# EAGLE schematic Magus (EAGLE 9.1.1)
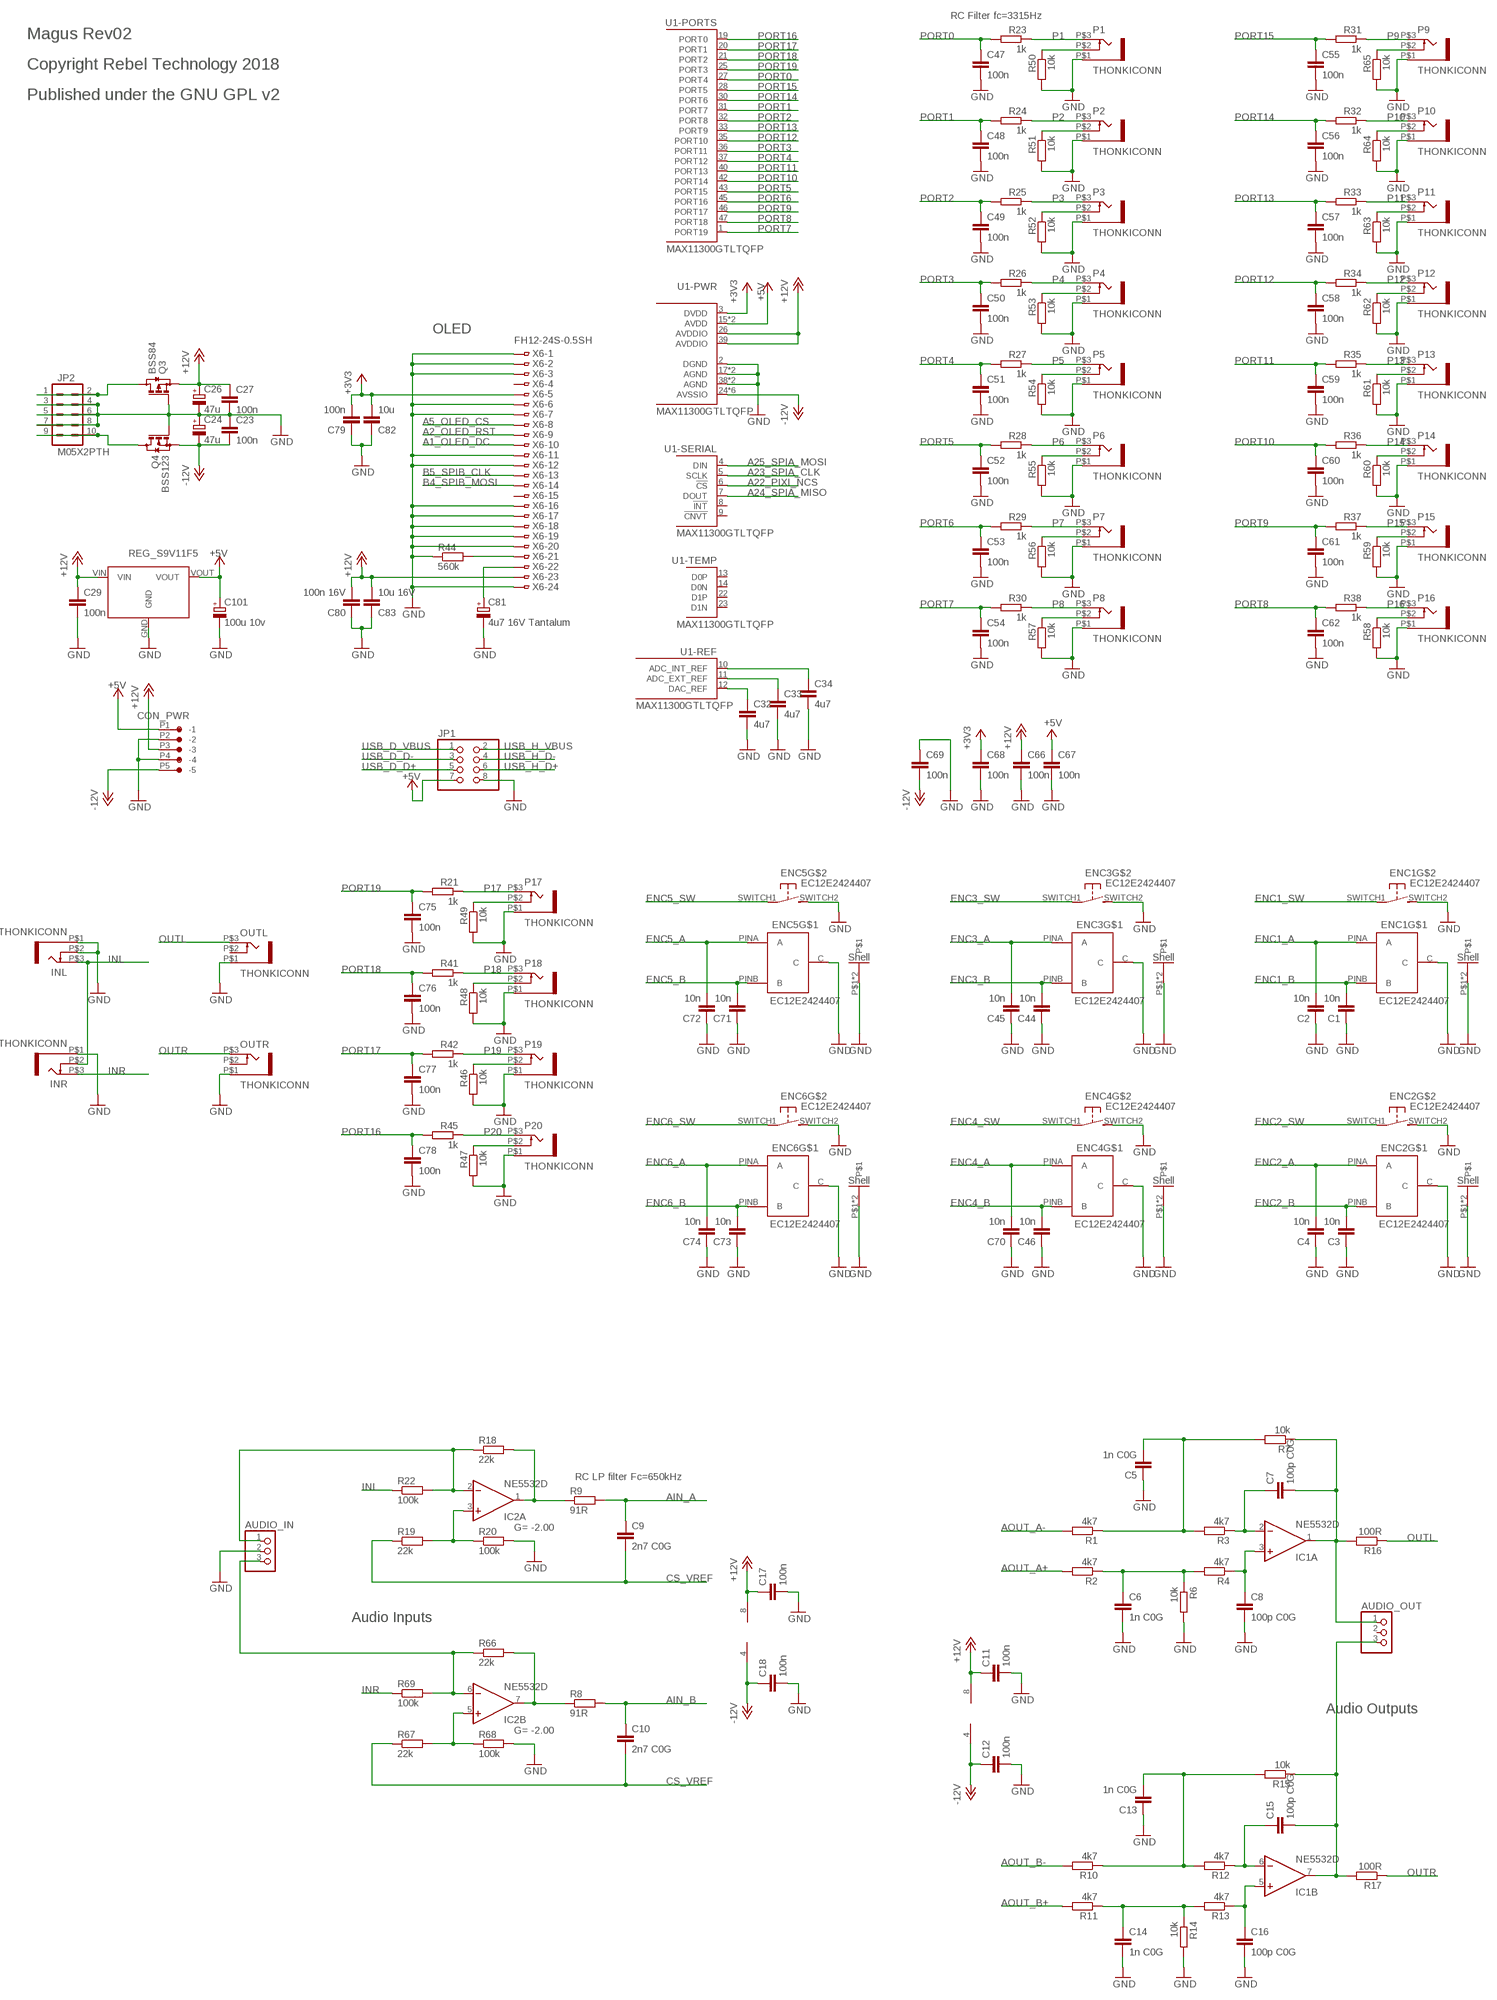
[diagram p0: schematic, sheet 1, part 1 of 2]
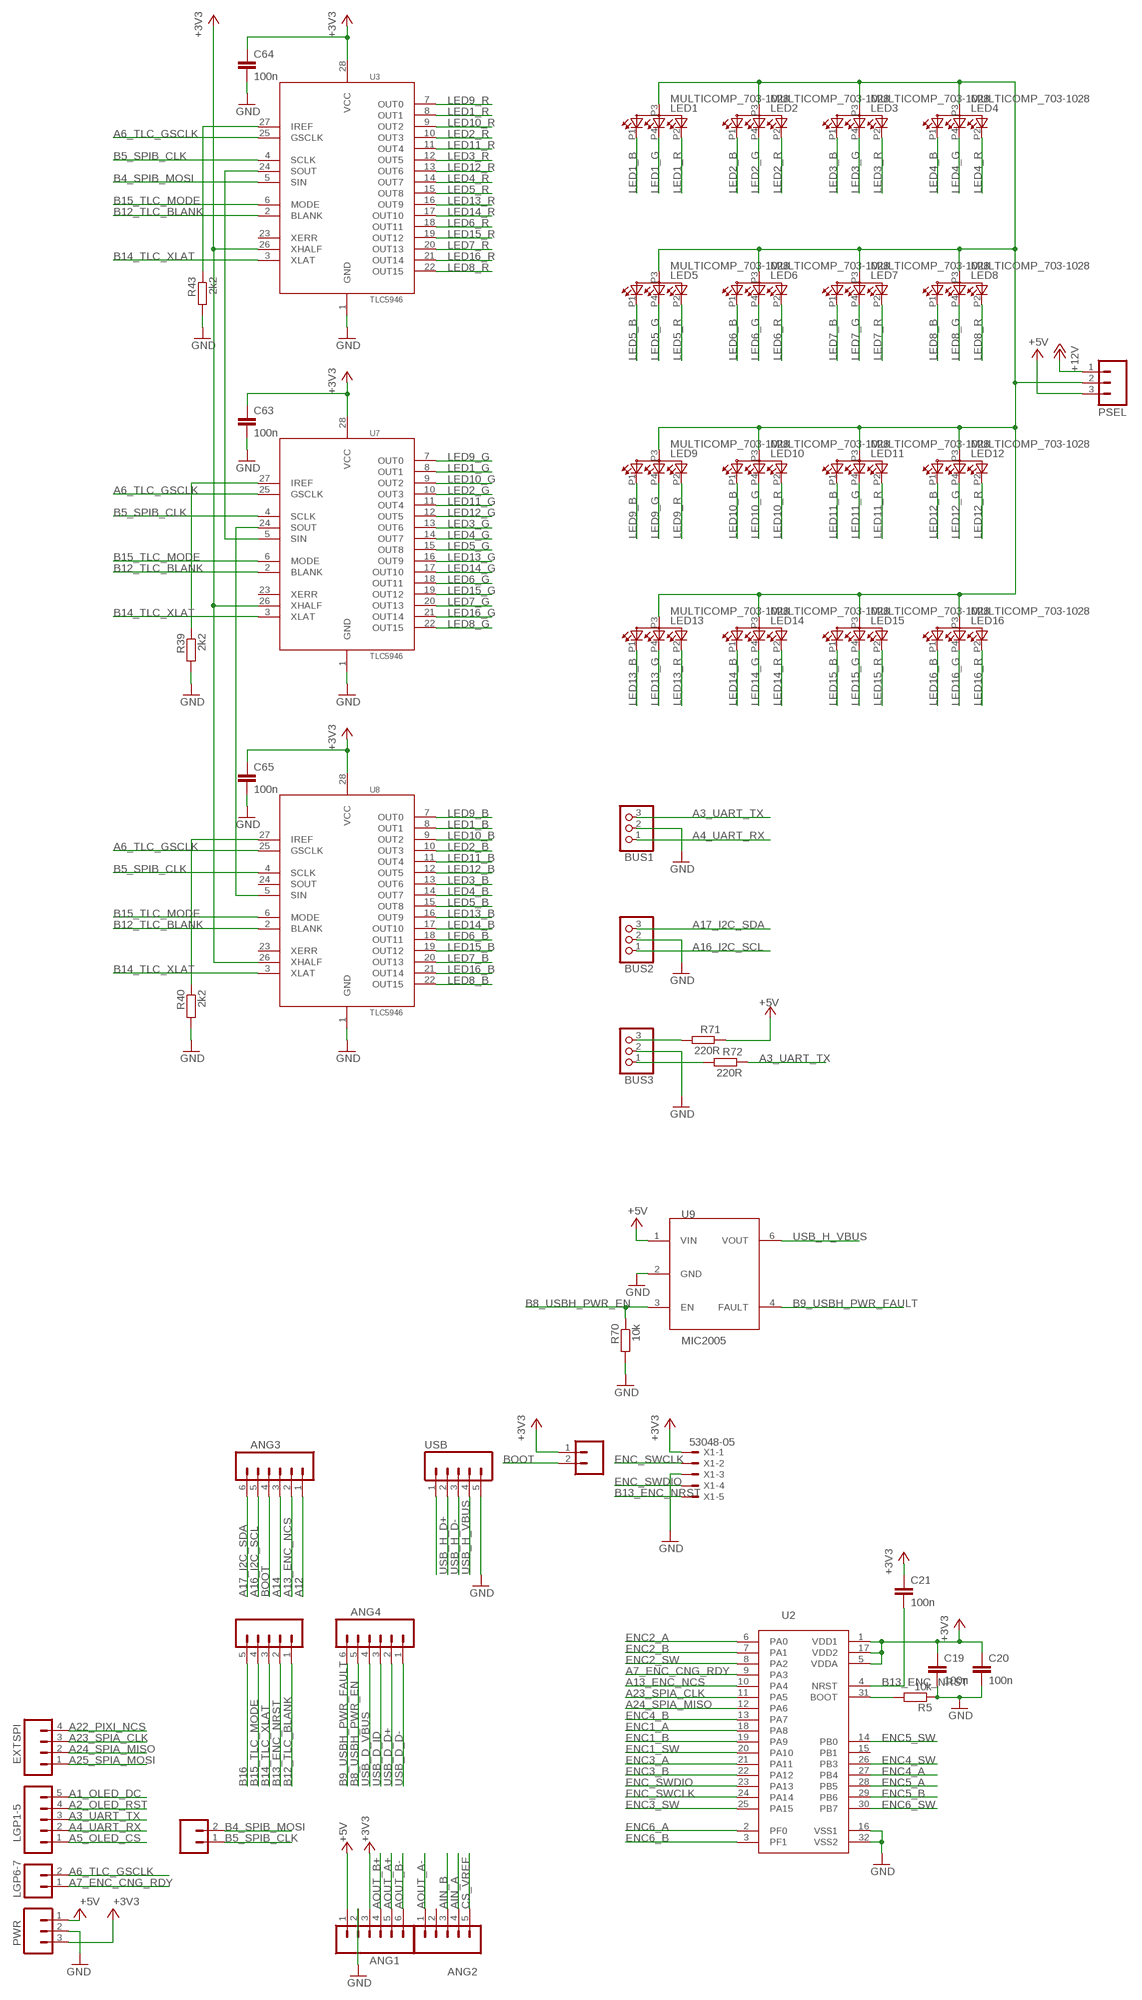
[diagram p1: schematic, sheet 1, part 2 of 2]

## Parts
ANG1  M06SIP  [1X06]
ANG2  M05PTH  [1X05]
ANG3  M06SIP  [1X06]
ANG4  M06SIP  [1X06]
AUDIO_IN  CON-JST-1X03PH-TH  [JST-B3B-PH-KL]
AUDIO_OUT  CON-JST-1X03PH-TH  [JST-B3B-PH-KL]
BOOT  M02PTH  [1X02]
BUS1  CON-JST-1X03PH-TH  [JST-B3B-PH-KL]
BUS2  CON-JST-1X03PH-TH  [JST-B3B-PH-KL]
BUS3  CON-JST-1X03PH-TH  [JST-B3B-PH-KL]
C1  10n  C-EUC0603  [C0603]
C2  10n  C-EUC0603  [C0603]
C3  10n  C-EUC0603  [C0603]
C4  10n  C-EUC0603  [C0603]
C5  1n C0G  C-EUC0603  [C0603]
C6  1n C0G  C-EUC0603  [C0603]
C7  100p C0G  C-EUC0603  [C0603]
C8  100p C0G  C-EUC0603  [C0603]
C9  2n7 C0G  C-EUC0603  [C0603]
C10  2n7 C0G  C-EUC0603  [C0603]
C11  100n  C-EUC0603  [C0603]
C12  100n  C-EUC0603  [C0603]
C13  1n C0G  C-EUC0603  [C0603]
C14  1n C0G  C-EUC0603  [C0603]
C15  100p C0G  C-EUC0603  [C0603]
C16  100p C0G  C-EUC0603  [C0603]
C17  100n  C-EUC0603  [C0603]
C18  100n  C-EUC0603  [C0603]
C19  100n  C-EUC0603  [C0603]
C20  100n  C-EUC0603  [C0603]
C21  100n  C-EUC0603  [C0603]
C23  100n  C-EUC0603  [C0603]
C24  47u  CPOL-EUB  [PANASONIC_B]
C26  47u  CPOL-EUB  [PANASONIC_B]
C27  100n  C-EUC0603  [C0603]
C29  100n  C-EUC0603  [C0603]
C32  4u7  C-EUC0603  [C0603]
C33  4u7  C-EUC0603  [C0603]
C34  4u7  C-EUC0603  [C0603]
C44  10n  C-EUC0603  [C0603]
C45  10n  C-EUC0603  [C0603]
C46  10n  C-EUC0603  [C0603]
C47  100n  C-EUC0603  [C0603]
C48  100n  C-EUC0603  [C0603]
C49  100n  C-EUC0603  [C0603]
C50  100n  C-EUC0603  [C0603]
C51  100n  C-EUC0603  [C0603]
C52  100n  C-EUC0603  [C0603]
C53  100n  C-EUC0603  [C0603]
C54  100n  C-EUC0603  [C0603]
C55  100n  C-EUC0603  [C0603]
C56  100n  C-EUC0603  [C0603]
C57  100n  C-EUC0603  [C0603]
C58  100n  C-EUC0603  [C0603]
C59  100n  C-EUC0603  [C0603]
C60  100n  C-EUC0603  [C0603]
C61  100n  C-EUC0603  [C0603]
C62  100n  C-EUC0603  [C0603]
C63  100n  C-EUC0603  [C0603]
C64  100n  C-EUC0603  [C0603]
C65  100n  C-EUC0603  [C0603]
C66  100n  C-EUC0603  [C0603]
C67  100n  C-EUC0603  [C0603]
C68  100n  C-EUC0603  [C0603]
C69  100n  C-EUC0603  [C0603]
C70  10n  C-EUC0603  [C0603]
C71  10n  C-EUC0603  [C0603]
C72  10n  C-EUC0603  [C0603]
C73  10n  C-EUC0603  [C0603]
C74  10n  C-EUC0603  [C0603]
C75  100n  C-EUC0603  [C0603]
C76  100n  C-EUC0603  [C0603]
C77  100n  C-EUC0603  [C0603]
C78  100n  C-EUC0603  [C0603]
C79  100n  C-EUC0603  [C0603]
C80  100n 16V  C-EUC0603  [C0603]
C81  4u7 16V Tantalum  CPOL-EUSMCA  [SMC_A]
C82  10u  C-EUC1206  [C1206]
C83  10u 16V  C-EUC1206  [C1206]
C101  100u 10v  CPOL-EU153CLV-0505  [CPOL-5]
CON_PWR  CON-JST_PH_5W  [CON-JST_PH_5W]
ENC1  EC12E2424407  [EC12E2424407]
ENC2  EC12E2424407  [EC12E2424407]
ENC3  EC12E2424407  [EC12E2424407]
ENC4  EC12E2424407  [EC12E2424407]
ENC5  EC12E2424407  [EC12E2424407]
ENC6  EC12E2424407  [EC12E2424407]
EXTSPI  M04PTH  [1X04]
IC1  NE5532D  [SO08]
IC2  NE5532D  [SO08]
INL  THONKICONN  [THONKICONN]
INR  THONKICONN  [THONKICONN]
JP1  PINHD-2X4  [2X04]
JP2  M05X2PTH  [AVR_ICSP]
LED1  MULTICOMP_703-1028  [RGB-LED-703-1028]
LED2  MULTICOMP_703-1028  [RGB-LED-703-1028]
LED3  MULTICOMP_703-1028  [RGB-LED-703-1028]
LED4  MULTICOMP_703-1028  [RGB-LED-703-1028]
LED5  MULTICOMP_703-1028  [RGB-LED-703-1028]
LED6  MULTICOMP_703-1028  [RGB-LED-703-1028]
LED7  MULTICOMP_703-1028  [RGB-LED-703-1028]
LED8  MULTICOMP_703-1028  [RGB-LED-703-1028]
LED9  MULTICOMP_703-1028  [RGB-LED-703-1028]
LED10  MULTICOMP_703-1028  [RGB-LED-703-1028]
LED11  MULTICOMP_703-1028  [RGB-LED-703-1028]
LED12  MULTICOMP_703-1028  [RGB-LED-703-1028]
LED13  MULTICOMP_703-1028  [RGB-LED-703-1028]
LED14  MULTICOMP_703-1028  [RGB-LED-703-1028]
LED15  MULTICOMP_703-1028  [RGB-LED-703-1028]
LED16  MULTICOMP_703-1028  [RGB-LED-703-1028]
LGP1-5  M05PTH  [1X05]
LGP6-1  M02PTH  [1X02]
LGP6-7  M02PTH  [1X02]
OUTL  THONKICONN  [THONKICONN]
OUTR  THONKICONN  [THONKICONN]
P1  THONKICONN  [THONKICONN]
P2  THONKICONN  [THONKICONN]
P3  THONKICONN  [THONKICONN]
P4  THONKICONN  [THONKICONN]
P5  THONKICONN  [THONKICONN]
P6  THONKICONN  [THONKICONN]
P7  THONKICONN  [THONKICONN]
P8  THONKICONN  [THONKICONN]
P9  THONKICONN  [THONKICONN]
P10  THONKICONN  [THONKICONN]
P11  THONKICONN  [THONKICONN]
P12  THONKICONN  [THONKICONN]
P13  THONKICONN  [THONKICONN]
P14  THONKICONN  [THONKICONN]
P15  THONKICONN  [THONKICONN]
P16  THONKICONN  [THONKICONN]
P17  THONKICONN  [THONKICONN]
P18  THONKICONN  [THONKICONN]
P19  THONKICONN  [THONKICONN]
P20  THONKICONN  [THONKICONN]
PSEL  M03PTH  [1X03]
PWR  M03PTH  [1X03]
Q3  BSS84  [SOT23]
Q4  BSS123  [SOT23]
R1  4k7  R-EU_0603  [0603]
R2  4k7  R-EU_0603  [0603]
R3  4k7  R-EU_0603  [0603]
R4  4k7  R-EU_0603  [0603]
R5  10k  R-EU_0603  [0603]
R6  10k  R-EU_0603  [0603]
R7  10k  R-EU_0603  [0603]
R8  91R  R-EU_0603  [0603]
R9  91R  R-EU_0603  [0603]
R10  4k7  R-EU_0603  [0603]
R11  4k7  R-EU_0603  [0603]
R12  4k7  R-EU_0603  [0603]
R13  4k7  R-EU_0603  [0603]
R14  10k  R-EU_0603  [0603]
R15  10k  R-EU_0603  [0603]
R16  100R  R-EU_0603  [0603]
R17  100R  R-EU_0603  [0603]
R18  22k  R-EU_0603  [0603]
R19  22k  R-EU_0603  [0603]
R20  100k  R-EU_0603  [0603]
R21  1k  R-EU_0603  [0603]
R22  100k  R-EU_0603  [0603]
R23  1k  R-EU_0603  [0603]
R24  1k  R-EU_0603  [0603]
R25  1k  R-EU_0603  [0603]
R26  1k  R-EU_0603  [0603]
R27  1k  R-EU_0603  [0603]
R28  1k  R-EU_0603  [0603]
R29  1k  R-EU_0603  [0603]
R30  1k  R-EU_0603  [0603]
R31  1k  R-EU_0603  [0603]
R32  1k  R-EU_0603  [0603]
R33  1k  R-EU_0603  [0603]
R34  1k  R-EU_0603  [0603]
R35  1k  R-EU_0603  [0603]
R36  1k  R-EU_0603  [0603]
R37  1k  R-EU_0603  [0603]
R38  1k  R-EU_0603  [0603]
R39  2k2  R-EU_0603  [0603]
R40  2k2  R-EU_0603  [0603]
R41  1k  R-EU_0603  [0603]
R42  1k  R-EU_0603  [0603]
R43  2k2  R-EU_0603  [0603]
R44  560k  R-EU_0603  [0603]
R45  1k  R-EU_0603  [0603]
R46  10k  R-EU_0603  [0603]
R47  10k  R-EU_0603  [0603]
R48  10k  R-EU_0603  [0603]
R49  10k  R-EU_0603  [0603]
R50  10k  R-EU_0603  [0603]
R51  10k  R-EU_0603  [0603]
R52  10k  R-EU_0603  [0603]
R53  10k  R-EU_0603  [0603]
R54  10k  R-EU_0603  [0603]
R55  10k  R-EU_0603  [0603]
R56  10k  R-EU_0603  [0603]
R57  10k  R-EU_0603  [0603]
R58  10k  R-EU_0603  [0603]
R59  10k  R-EU_0603  [0603]
R60  10k  R-EU_0603  [0603]
R61  10k  R-EU_0603  [0603]
R62  10k  R-EU_0603  [0603]
R63  10k  R-EU_0603  [0603]
R64  10k  R-EU_0603  [0603]
R65  10k  R-EU_0603  [0603]
R66  22k  R-EU_0603  [0603]
R67  22k  R-EU_0603  [0603]
R68  100k  R-EU_0603  [0603]
R69  100k  R-EU_0603  [0603]
R70  10k  R-EU_0603  [0603]
R71  220R  R-EU_0603  [0603]
R72  220R  R-EU_0603  [0603]
U1  MAX11300GTLTQFP  [TQFP48]
U2  STM32F051K4T6  [LQFP32-7X7]
U3  TLC5946  [TSSOP28]
U4  REG_S9V11F5  [REG_S9V11F5]
U7  TLC5946  [TSSOP28]
U8  TLC5946  [TSSOP28]
U9  MIC2005  [SOT23-6]
USB  M05PTH  [1X05]
USB1  M05PTH  [1X05]
X1  53048-05  [53048-05]
X6  FH12-24S-0.5SH  [FH12-24S-0.5SH]

## Nets
+3V3: ANG1.3 BOOT.1 C19.1 C20.1 C21.1 C63.1 C64.1 C65.1 C68.1 C79.2 C82.2 PWR.3 U1.3(-PWR:DVDD) U2.1(VDD1) U2.5(VDDA) U2.17(VDD2) U3.26(XHALF) U3.28(VCC) U7.26(XHALF) U7.28(VCC) U8.26(XHALF) U8.28(VCC) X1.1 X6.5
+5V [power]: ANG1.1 C67.1 C101.+ CON_PWR.P1(-1) JP1.7 PSEL.3 PWR.1 R71.1 U1.15(-PWR:AVDD) U1.16(-PWR:AVDD) U4.VOUT U9.1(VIN)
+12V: C11.1 C17.1 C26.+ C27.1 C29.1 C66.1 C80.2 C83.2 CON_PWR.P3(-3) IC1.8(P:V+) IC2.8(P:V+) PSEL.1 Q3.2(S) U1.26(-PWR:AVDDIO) U1.39(-PWR:AVDDIO) U4.VIN X6.23
-12V: C12.1 C18.1 C23.2 C24.- C69.2 CON_PWR.P5(-5) IC1.4(P:V-) IC2.4(P:V-) Q4.2(S) U1.24(-PWR:AVSSIO) U1.29(-PWR:AVSSIO) U1.34(-PWR:AVSSIO) U1.41(-PWR:AVSSIO) U1.44(-PWR:AVSSIO) U1.48(-PWR:AVSSIO)
A1_OLED_DC: LGP1-5.5 X6.10
A2_OLED_RST: LGP1-5.4 X6.9
A3_UART_TX: BUS1.3 LGP1-5.3 R72.1
A4_UART_RX: BUS1.1 LGP1-5.2
A5_OLED_CS: LGP1-5.1 X6.8
A6_TLC_GSCLK: LGP6-7.2 U3.25(GSCLK) U7.25(GSCLK) U8.25(GSCLK)
A7_ENC_CNG_RDY: LGP6-7.1 U2.9(PA3)
A12: ANG3.1
A13_ENC_NCS: ANG3.2 U2.10(PA4)
A14: ANG3.3
A16_I2C_SCL: ANG3.5 BUS2.1
A17_I2C_SDA: ANG3.6 BUS2.3
A22_PIXI_NCS: EXTSPI.4 U1.6(-SERIAL:!CS!)
A23_SPIA_CLK: EXTSPI.3 U1.5(-SERIAL:SCLK) U2.11(PA5)
A24_SPIA_MISO: EXTSPI.2 U1.7(-SERIAL:DOUT) U2.12(PA6)
A25_SPIA_MOSI: EXTSPI.1 U1.4(-SERIAL:DIN)
AIN_A: ANG2.4 C9.1 R9.2
AIN_B: ANG2.3 C10.1 R8.2
ANALOG_OUTA1: AUDIO_OUT.1 C7.2 IC1.1(A:OUT) R7.1 R16.2
ANALOG_OUTB1: AUDIO_OUT.3 C15.2 IC1.7(B:OUT) R15.1 R17.2
AOUT_A+: ANG1.5 R2.2
AOUT_A-: ANG2.1 R1.2
AOUT_B+: ANG1.4 R11.2
AOUT_B-: ANG1.6 R10.2
B4_SPIB_MOSI: LGP6-1.2 U3.5(SIN) X6.14
B5_SPIB_CLK: LGP6-1.1 U3.4(SCLK) U7.4(SCLK) U8.4(SCLK) X6.13
B8_USBH_PWR_EN: ANG4.5 R70.1 U9.3(EN)
B9_USBH_PWR_FAULT: ANG4.6 U9.4(FAULT)
B12_TLC_BLANK: U3.2(BLANK) U7.2(BLANK) U8.2(BLANK) USB1.1
B13_ENC_NRST: C21.2 U2.4(NRST) USB1.2 X1.5
B14_TLC_XLAT: U3.3(XLAT) U7.3(XLAT) U8.3(XLAT) USB1.3
B15_TLC_MODE: U3.6(MODE) U7.6(MODE) U8.6(MODE) USB1.4
B16: USB1.5
BOOT: ANG3.4 BOOT.2
CS_VREF: ANG2.5 C9.2 C10.2 R19.1 R67.1
ENC1_A: C2.2 ENC1.PINA(A) U2.18(PA8)
ENC1_B: C1.2 ENC1.PINB(B) U2.19(PA9)
ENC1_SW: ENC1.SWITCH1(P) U2.20(PA10)
ENC2_A: C4.2 ENC2.PINA(A) U2.6(PA0)
ENC2_B: C3.2 ENC2.PINB(B) U2.7(PA1)
ENC2_SW: ENC2.SWITCH1(P) U2.8(PA2)
ENC3_A: C45.2 ENC3.PINA(A) U2.21(PA11)
ENC3_B: C44.2 ENC3.PINB(B) U2.22(PA12)
ENC3_SW: ENC3.SWITCH1(P) U2.25(PA15)
ENC4_A: C70.2 ENC4.PINA(A) U2.27(PB4)
ENC4_B: C46.2 ENC4.PINB(B) U2.13(PA7)
ENC4_SW: ENC4.SWITCH1(P) U2.26(PB3)
ENC5_A: C72.2 ENC5.PINA(A) U2.28(PB5)
ENC5_B: C71.2 ENC5.PINB(B) U2.29(PB6)
ENC5_SW: ENC5.SWITCH1(P) U2.14(PB0)
ENC6_A: C74.2 ENC6.PINA(A) U2.2(PF0)
ENC6_B: C73.2 ENC6.PINB(B) U2.3(PF1)
ENC6_SW: ENC6.SWITCH1(P) U2.30(PB7)
ENC_SWCLK: U2.24(PA14) X1.2
ENC_SWDIO: U2.23(PA13) X1.4
GND: ANG1.2 AUDIO_IN.2 BUS1.2 BUS2.2 BUS3.2 C1.1 C2.1 C3.1 C4.1 C5.1 C6.2 C8.2 C11.2 C12.2 C13.1 C14.2 C16.2 C17.2 C18.2 C19.2 C20.2 C23.1 C24.+ C26.- C27.2 C29.2 C32.2 C33.2 C34.2 C44.1 C45.1 C46.1 C47.2 C48.2 C49.2 C50.2 C51.2 C52.2 C53.2 C54.2 C55.2 C56.2 C57.2 C58.2 C59.2 C60.2 C61.2 C62.2 C63.2 C64.2 C65.2 C66.2 C67.2 C68.2 C69.1 C70.1 C71.1 C72.1 C73.1 C74.1 C75.2 C76.2 C77.2 C78.2 C79.1 C80.1 C81.- C82.1 C83.1 C101.- CON_PWR.P2(-2) CON_PWR.P4(-4) ENC1.C ENC1.P$1 ENC1.P$2 ENC1.SWITCH2(S) ENC2.C ENC2.P$1 ENC2.P$2 ENC2.SWITCH2(S) ENC3.C ENC3.P$1 ENC3.P$2 ENC3.SWITCH2(S) ENC4.C ENC4.P$1 ENC4.P$2 ENC4.SWITCH2(S) ENC5.C ENC5.P$1 ENC5.P$2 ENC5.SWITCH2(S) ENC6.C ENC6.P$1 ENC6.P$2 ENC6.SWITCH2(S) INL.P$1 INL.P$2 INR.P$1 JP1.8 JP2.3 JP2.4 JP2.5 JP2.7 JP2.8 OUTL.P$1 OUTR.P$1 P1.P$1 P2.P$1 P3.P$1 P4.P$1 P5.P$1 P6.P$1 P7.P$1 P8.P$1 P9.P$1 P10.P$1 P11.P$1 P12.P$1 P13.P$1 P14.P$1 P15.P$1 P16.P$1 P17.P$1 P18.P$1 P19.P$1 P20.P$1 PWR.2 Q3.1(G) Q4.1(G) R5.1 R6.2 R14.2 R20.2 R39.2 R40.2 R43.2 R44.1 R46.2 R47.2 R48.2 R49.2 R50.2 R51.2 R52.2 R53.2 R54.2 R55.2 R56.2 R57.2 R58.2 R59.2 R60.2 R61.2 R62.2 R63.2 R64.2 R65.2 R68.2 R70.2 U1.2(-PWR:DGND) U1.17(-PWR:AGND) U1.18(-PWR:AGND) U1.38(-PWR:AGND) U1.EP(-PWR:AGND) U2.16(VSS1) U2.32(VSS2) U3.1(GND) U4.GND U7.1(GND) U8.1(GND) U9.2(GND) USB.5 X1.3 X6.1 X6.2 X6.3 X6.6 X6.7 X6.11 X6.12 X6.16 X6.17 X6.18 X6.19 X6.20 X6.24
INL: INL.P$3 INR.P$2 R22.1
INR: INR.P$3 R69.1
LED1_B: LED1.P1(CRED) U8.8(OUT1)
LED1_G: LED1.P4(CBLUE) U7.8(OUT1)
LED1_R: LED1.P2(CGREEN) U3.8(OUT1)
LED2_B: LED2.P1(CRED) U8.10(OUT3)
LED2_G: LED2.P4(CBLUE) U7.10(OUT3)
LED2_R: LED2.P2(CGREEN) U3.10(OUT3)
LED3_B: LED3.P1(CRED) U8.13(OUT6)
LED3_G: LED3.P4(CBLUE) U7.13(OUT6)
LED3_R: LED3.P2(CGREEN) U3.12(OUT5)
LED4_B: LED4.P1(CRED) U8.14(OUT7)
LED4_G: LED4.P4(CBLUE) U7.14(OUT7)
LED4_R: LED4.P2(CGREEN) U3.14(OUT7)
LED5_B: LED5.P1(CRED) U8.15(OUT8)
LED5_G: LED5.P4(CBLUE) U7.15(OUT8)
LED5_R: LED5.P2(CGREEN) U3.15(OUT8)
LED6_B: LED6.P1(CRED) U8.18(OUT11)
LED6_G: LED6.P4(CBLUE) U7.18(OUT11)
LED6_R: LED6.P2(CGREEN) U3.18(OUT11)
LED7_B: LED7.P1(CRED) U8.20(OUT13)
LED7_G: LED7.P4(CBLUE) U7.20(OUT13)
LED7_R: LED7.P2(CGREEN) U3.20(OUT13)
LED8_B: LED8.P1(CRED) U8.22(OUT15)
LED8_G: LED8.P4(CBLUE) U7.22(OUT15)
LED8_R: LED8.P2(CGREEN) U3.22(OUT15)
LED9_B: LED9.P1(CRED) U8.7(OUT0)
LED9_G: LED9.P4(CBLUE) U7.7(OUT0)
LED9_R: LED9.P2(CGREEN) U3.7(OUT0)
LED10_B: LED10.P1(CRED) U8.9(OUT2)
LED10_G: LED10.P4(CBLUE) U7.9(OUT2)
LED10_R: LED10.P2(CGREEN) U3.9(OUT2)
LED11_B: LED11.P1(CRED) U8.11(OUT4)
LED11_G: LED11.P4(CBLUE) U7.11(OUT4)
LED11_R: LED11.P2(CGREEN) U3.11(OUT4)
LED12_B: LED12.P1(CRED) U8.12(OUT5)
LED12_G: LED12.P4(CBLUE) U7.12(OUT5)
LED12_R: LED12.P2(CGREEN) U3.13(OUT6)
LED13_B: LED13.P1(CRED) U8.16(OUT9)
LED13_G: LED13.P4(CBLUE) U7.16(OUT9)
LED13_R: LED13.P2(CGREEN) U3.16(OUT9)
LED14_B: LED14.P1(CRED) U8.17(OUT10)
LED14_G: LED14.P4(CBLUE) U7.17(OUT10)
LED14_R: LED14.P2(CGREEN) U3.17(OUT10)
LED15_B: LED15.P1(CRED) U8.19(OUT12)
LED15_G: LED15.P4(CBLUE) U7.19(OUT12)
LED15_R: LED15.P2(CGREEN) U3.19(OUT12)
LED16_B: LED16.P1(CRED) U8.21(OUT14)
LED16_G: LED16.P4(CBLUE) U7.21(OUT14)
LED16_R: LED16.P2(CGREEN) U3.21(OUT14)
LED_PWR: LED1.P3(A) LED2.P3(A) LED3.P3(A) LED4.P3(A) LED5.P3(A) LED6.P3(A) LED7.P3(A) LED8.P3(A) LED9.P3(A) LED10.P3(A) LED11.P3(A) LED12.P3(A) LED13.P3(A) LED14.P3(A) LED15.P3(A) LED16.P3(A) PSEL.2
N$1: C34.1 U1.10(-REF:ADC_INT_REF)
N$2: IC2.3(A:+IN) R19.2 R20.1
N$3: AUDIO_IN.1 IC2.2(A:-IN) R18.1 R22.2
N$4: IC2.1(A:OUT) R9.1 R18.2
N$5: IC2.5(B:+IN) R67.2 R68.1
N$6: AUDIO_IN.3 IC2.6(B:-IN) R66.1 R69.2
N$7: C33.1 U1.11(-REF:ADC_EXT_REF)
N$8: IC2.7(B:OUT) R8.1 R66.2
N$9: C32.1 U1.12(-REF:DAC_REF)
N$10: JP2.9 JP2.10 Q4.3(D)
N$11: C6.1 R2.1 R4.2 R6.1
N$12: C5.2 R1.1 R3.2 R7.2
N$13: JP2.1 JP2.2 Q3.3(D)
N$14: BUS3.3 R71.2
N$15: C7.1 IC1.2(A:-IN) R3.1
N$17: C8.1 IC1.3(A:+IN) R4.1
N$18: C14.1 R11.1 R13.2 R14.1
N$19: C13.2 R10.1 R12.2 R15.2
N$20: C15.1 IC1.6(B:-IN) R12.1
N$21: C16.1 IC1.5(B:+IN) R13.1
N$25: BUS3.1 R72.2
N$26: USB.1
N$28: R5.2 U2.31(BOOT)
N$48: U3.24(SOUT) U7.5(SIN)
N$49: R39.1 U7.27(IREF)
N$52: R40.1 U8.27(IREF)
N$53: U7.24(SOUT) U8.5(SIN)
N$55: P9.P$2 R65.1
N$56: P10.P$2 R64.1
N$57: R43.1 U3.27(IREF)
N$58: P11.P$2 R63.1
N$59: P12.P$2 R62.1
N$60: P13.P$2 R61.1
N$61: P14.P$2 R60.1
N$62: P15.P$2 R59.1
N$63: P16.P$2 R58.1
N$64: P8.P$2 R57.1
N$65: P7.P$2 R56.1
N$66: P6.P$2 R55.1
N$67: P5.P$2 R54.1
N$68: P4.P$2 R53.1
N$69: P3.P$2 R52.1
N$70: P2.P$2 R51.1
N$71: P1.P$2 R50.1
N$72: P17.P$2 R49.1
N$73: P18.P$2 R48.1
N$74: P19.P$2 R46.1
N$75: P20.P$2 R47.1
N$76: C81.+ X6.22
N$77: R44.2 X6.21
OUTL: OUTL.P$3 R16.1
OUTR: OUTR.P$3 R17.1
P1: P1.P$3 R23.1
P2: P2.P$3 R24.1
P3: P3.P$3 R25.1
P4: P4.P$3 R26.1
P5: P5.P$3 R27.1
P6: P6.P$3 R28.1
P7: P7.P$3 R29.1
P8: P8.P$3 R30.1
P9: P9.P$3 R31.1
P10: P10.P$3 R32.1
P11: P11.P$3 R33.1
P12: P12.P$3 R34.1
P13: P13.P$3 R35.1
P14: P14.P$3 R36.1
P15: P15.P$3 R37.1
P16: P16.P$3 R38.1
P17: P17.P$3 R21.1
P18: P18.P$3 R41.1
P19: P19.P$3 R42.1
P20: P20.P$3 R45.1
PORT0: C47.1 R23.2 U1.27(-PORTS:PORT4)
PORT1: C48.1 R24.2 U1.31(-PORTS:PORT7)
PORT2: C49.1 R25.2 U1.32(-PORTS:PORT8)
PORT3: C50.1 R26.2 U1.36(-PORTS:PORT11)
PORT4: C51.1 R27.2 U1.37(-PORTS:PORT12)
PORT5: C52.1 R28.2 U1.43(-PORTS:PORT15)
PORT6: C53.1 R29.2 U1.45(-PORTS:PORT16)
PORT7: C54.1 R30.2 U1.1(-PORTS:PORT19)
PORT8: C62.1 R38.2 U1.47(-PORTS:PORT18)
PORT9: C61.1 R37.2 U1.46(-PORTS:PORT17)
PORT10: C60.1 R36.2 U1.42(-PORTS:PORT14)
PORT11: C59.1 R35.2 U1.40(-PORTS:PORT13)
PORT12: C58.1 R34.2 U1.35(-PORTS:PORT10)
PORT13: C57.1 R33.2 U1.33(-PORTS:PORT9)
PORT14: C56.1 R32.2 U1.30(-PORTS:PORT6)
PORT15: C55.1 R31.2 U1.28(-PORTS:PORT5)
PORT16: C78.1 R45.2 U1.19(-PORTS:PORT0)
PORT17: C77.1 R42.2 U1.20(-PORTS:PORT1)
PORT18: C76.1 R41.2 U1.21(-PORTS:PORT2)
PORT19: C75.1 R21.2 U1.25(-PORTS:PORT3)
USB_D_D+: ANG4.2 JP1.5
USB_D_D-: ANG4.1 JP1.3
USB_D_VBUS: ANG4.4 JP1.1
USB_H_D+: JP1.6 USB.2
USB_H_D-: JP1.4 USB.3
USB_H_VBUS: JP1.2 U9.6(VOUT) USB.4
Unconnected: ANG2.2 ANG4.3 AUDIO_OUT.2 JP2.6 OUTL.P$2 OUTR.P$2 U1.8(-SERIAL:!INT!) U1.9(-SERIAL:!CNVT!) U1.13(-TEMP:D0P) U1.14(-TEMP:D0N) U1.22(-TEMP:D1P) U1.23(-TEMP:D1N) U2.15(PB1) U3.23(XERR) U7.23(XERR) U8.23(XERR) U8.24(SOUT) X6.4 X6.15

## Notes on the sheet
- RC Filter fc=3315Hz
- Magus Rev02
- Copyright Rebel Technology 2018
- Published under the GNU GPL v2
- OLED
- RC LP filter Fc=650kHz
- G= -2.00
- Audio Inputs
- Audio Outputs
- G= -2.00

## Library data of the parts
ANG1 ANG3 ANG4 = SparkFun:M06: Header 6 Standard 6-pin 0.1" header. Use with straight break away headers (SKU : PRT-00116), right angle break away headers (PRT-00553), swiss pins (PRT-00743), machine pins (PRT-00117), and female headers (PRT-00115). Molex polarized connector foot print use with SKU : PRT-08094 with associated crimp pins and housings. NOTES ON THE VARIANTS LOCK and LOCK_LONGPADS... This footprint was designed to help hold the alignment of a through-hole component (i.e. 6-pin header) while soldering it into place. You may notice that each hole has been shifted either up or down by 0.005 of an inch from it's more standard position (which is a perfectly straight line). This slight alteration caused the pins (the squares in the middle) to touch the edges of the holes. Because they are alternating, it causes a "brace" to hold the component in place. 0.005 has proven to be the perfect amount of "off-center" position when using our standard breakaway headers. Although looks a little odd when you look at the bare footprint, once you have a header in there, the alteration is very hard to notice. Also, if you push a header all the way into place, it is covered up entirely on the bottom side. This idea of altering the position of holes to aid alignment will be further integrated into the Sparkfun Library for other footprints. It can help hold any component with 3 or more connection pins.
ANG2 LGP1-5 USB USB1 = SparkFun:M05: Header 5 Standard 5-pin 0.1" header. Use with straight break away headers (SKU : PRT-00116), right angle break away headers (PRT-00553), swiss pins (PRT-00743), machine pins (PRT-00117), and female headers (PRT-00115). Molex polarized connector foot print use with SKU : PRT-08230 with associated crimp pins and housings.
AUDIO_IN AUDIO_OUT BUS1-BUS3 = Rebel:CON-JST-1X03
BOOT LGP6-1 LGP6-7 = SparkFun:M02: Header 2 Standard 2-pin 0.1" header. Use with straight break away headers (SKU : PRT-00116), right angle break away headers (PRT-00553), swiss pins (PRT-00743), machine pins (PRT-00117), and female headers (PRT-00115). Molex polarized connector foot print use with SKU : PRT-08233 with associated crimp pins and housings.
C1-C21 C23 C27 C29 C32-C34 C44-C80 C82 C83 = Rebel:C-EU: CAPACITOR, European symbol
C24 C26 C81 C101 = Rebel:CPOL-EU: POLARIZED CAPACITOR, European symbol
CON_PWR = Rebel:CON-JST_PH_5W
ENC1-ENC6 = Rebel:EC12E2424407: rotary encoder with switch EC12E2424407
EXTSPI = SparkFun:M04: Header 4 Standard 4-pin 0.1" header. Use with straight break away headers (SKU : PRT-00116), right angle break away headers (PRT-00553), swiss pins (PRT-00743), machine pins (PRT-00117), and female headers (PRT-00115). Molex polarized connector foot print use with SKU : PRT-08231 with associated crimp pins and housings. 1MM SMD Version SKU: PRT-10208
IC1 IC2 = linear:NE5532: AUDIO AMPLIFIER
INL INR OUTL OUTR P1-P20 = Rebel:THONKICONN
JP1 = pinhead:PINHD-2X4: PIN HEADER
JP2 = SparkFun:M05X2: Header 5x2 Standard 10-pin dual row 0.1" header. Commonly used with AVR-ISP. Use with Spark Fun Electronics SKU: PRT-00778
LED1-LED16 = Rebel:MULTICOMP_703-1028: Farnell: 2112143
PSEL PWR = SparkFun:M03: Header 3 Standard 3-pin 0.1" header. Use with straight break away headers (SKU : PRT-00116), right angle break away headers (PRT-00553), swiss pins (PRT-00743), machine pins (PRT-00117), and female headers (PRT-00115). Molex polarized connector foot print use with SKU : PRT-08232 with associated crimp pins and housings.
Q3 = transistor-small-signal:BSS84: P-CHANNEL MOS FET; OC_FARNELL: 1779264
Q4 = transistor-small-signal:BSS123: N-CHANNEL MOS FET; OC_FARNELL: 1843725
R1-R72 = Rebel:R-EU_: RESISTOR, European symbol
U1 = Rebel:MAX11300GTL: 12 BIT ADC / DAC
U2 = Rebel:STM32F051K4T6
U3 U7 U8 = Rebel:TLC5946
U4 = Rebel:REG_S9V11F5
U9 = James:MIC2005; OC_FARNELL: 2509882
X1 = con-molex:53?-05: CONNECTOR wire to board 1.25 mm (.049 inch) pitch header; MF: MOLEX; MPN: 53048-0510; OC_FARNELL: 9732926; OC_NEWARK: 57H4722
X6 = con-hirose:FH12-24S-0.5S: 0.5mm Pitch Connectors For FPC/FFC Source: Data sheet <http://www.hirose.co.jp/cataloge_hp/e58605370.pdf>; MPN: FH12-24S-0.5SH(55); OC_FARNELL: 1324552; OC_NEWARK: 34M6170

## Net classes
1 power: width 0.178 mm, drill 0.305 mm, clearance 0.178 mm to class 0, clearance 0.178 mm